# EAGLE design Pro_Micro (EAGLE 6.4)
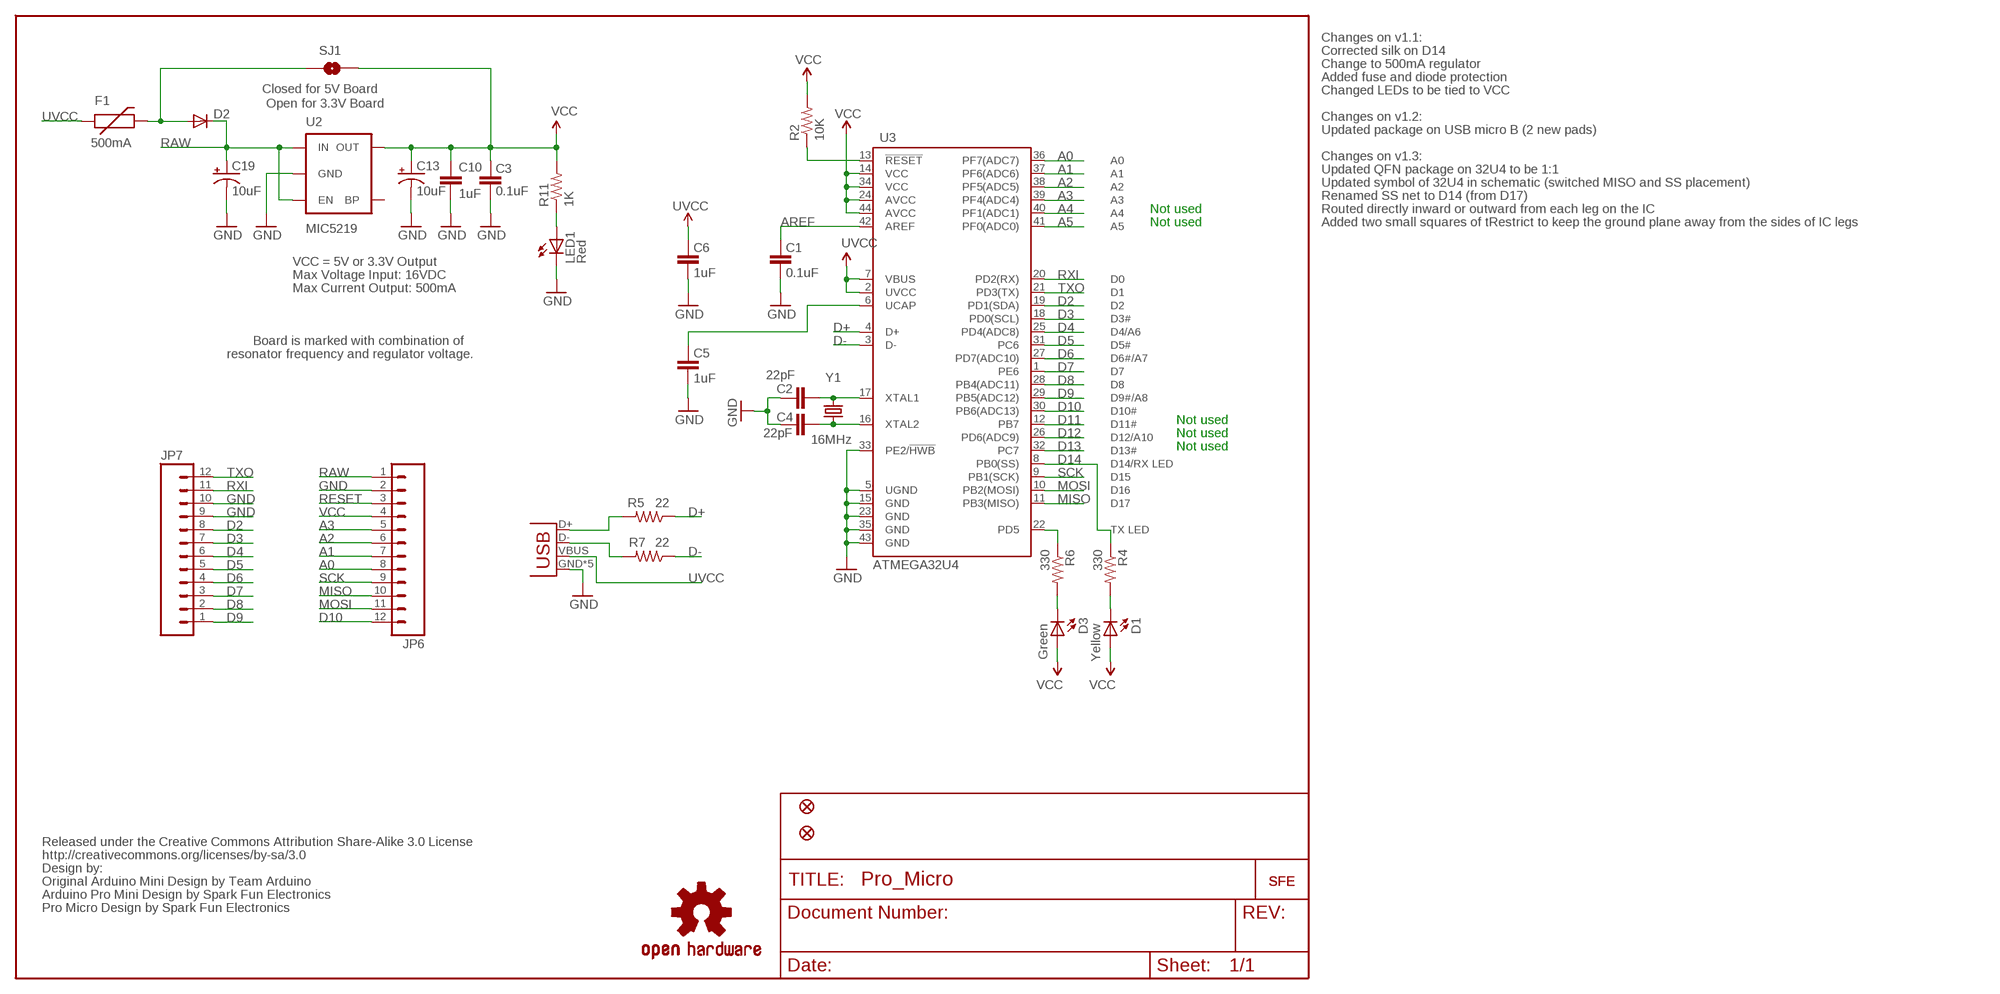
[diagram p0: schematic, sheet 1]

## Parts
C1  0.1uF  CAP0603-CAP  [0603-CAP]
C2  22pF  CAP0603-CAP  [0603-CAP]
C3  0.1uF  CAP0603-CAP  [0603-CAP]
C4  22pF  CAP0603-CAP  [0603-CAP]
C5  1uF  CAP0603-CAP  [0603-CAP]
C6  1uF  CAP0603-CAP  [0603-CAP]
C10  1uF  CAP0603-CAP  [0603-CAP]
C13  10uF  CAP_POL1206  [EIA3216]
C19  10uF  CAP_POL1206  [EIA3216]
D1  Yellow  LED0603  [LED-0603]
D2  DIODESOD  [SOD-323]
D3  Green  LED0603  [LED-0603]
F1  500mA  PTCSMD  [PTC-1206]
JP1  FIDUCIALUFIDUCIAL  [MICRO-FIDUCIAL]
JP2  FIDUCIALUFIDUCIAL  [MICRO-FIDUCIAL]
JP6  M12PTH  [1X12]
JP7  M12PTH  [1X12]
LED1  Red  LED0603  [LED-0603]
R2  10K  RESISTOR0603-RES  [0603-RES]
R4  330  RESISTOR0603-RES  [0603-RES]
R5  22  RESISTOR0603-RES  [0603-RES]
R6  330  RESISTOR0603-RES  [0603-RES]
R7  22  RESISTOR0603-RES  [0603-RES]
R11  1K  RESISTOR0603-RES  [0603-RES]
SJ1  Closed for 5V Board  SOLDERJUMPERNC  [SJ_2S]
U2  MIC5219  V_REG_LDOSMD  [SOT23-5]
U3  ATMEGA32U4  ATMEGA32U41:1  [QFN-44-NOPAD_1:1]
U$1  LOGO-SFESK  [SFE-LOGO-FLAME]
U$3  OSHW-LOGOS  [OSHW-LOGO-S]
U$5  CREATIVE_COMMONS  [CREATIVE_COMMONS]
U$11  LOGO-SFENEW  [SFE-NEW-WEBLOGO]
X1  USB-MICROB  [USB-MICROB]
Y1  16MHz  CRYSTAL5X3  [CRYSTAL-SMD-5X3]

## Nets
A0: JP6.8 U3.36(PF7(ADC7))
A1: JP6.7 U3.37(PF6(ADC6))
A2: JP6.6 U3.38(PF5(ADC5))
A3: JP6.5 U3.39(PF4(ADC4))
A4: U3.40(PF1(ADC1))
A5: U3.41(PF0(ADC0))
AREF: C1.2 U3.42(AREF)
D2: JP7.8 U3.19(PD1(SDA))
D3: JP7.7 U3.18(PD0(SCL))
D4: JP7.6 U3.25(PD4(ADC8))
D5: JP7.5 U3.31(PC6)
D6: JP7.4 U3.27(PD7(ADC10))
D7: JP7.3 U3.1(PE6)
D8: JP7.2 U3.28(PB4(ADC11))
D9: JP7.1 U3.29(PB5(ADC12))
D10: JP6.12 U3.30(PB6(ADC13))
D11: U3.12(PB7)
D12: U3.26(PD6(ADC9))
D13: U3.32(PC7)
D14: R4.1 U3.8(PB0(SS))
D+: R5.1 U3.4(D+)
D-: R7.1 U3.3(D-)
GND [vcc]: C1.1 C2.2 C3.1 C4.2 C5.1 C6.1 C10.2 C13.C(-) C19.C(-) JP6.2 JP7.9 JP7.10 LED1.C U2.2(GND) U3.5(UGND) U3.15(GND) U3.23(GND) U3.33(PE2/!HWB) U3.35(GND) U3.43(GND) X1.GND X1.MT1(GND) X1.MT2(GND) X1.MT3(GND) X1.MT4(GND)
MISO: JP6.10 U3.11(PB3(MISO))
MOSI: JP6.11 U3.10(PB2(MOSI))
N$1: C4.1 U3.16(XTAL2) Y1.1
N$2: C2.1 U3.17(XTAL1) Y1.3
N$3: D2.2(A) F1.2 SJ1.1
N$4: C5.2 U3.6(UCAP)
N$5: D1.C R4.2
N$6: R7.2 X1.D-
N$7: D3.C R6.2
N$8: R5.2 X1.D+
N$38: LED1.A R11.1
RAW [vcc]: C19.A(+) D2.1(C) JP6.1 U2.1(IN) U2.3(EN)
RESET: JP6.3 R2.1 U3.13(!RESET)
RXI: JP7.11 U3.20(PD2(RX))
SCK: JP6.9 U3.9(PB1(SCK))
TXLED: R6.1 U3.22(PD5)
TXO: JP7.12 U3.21(PD3(TX))
UVCC: C6.2 F1.1 U3.2(UVCC) U3.7(VBUS) X1.VBUS
VCC: C3.2 C10.1 C13.A(+) D1.A D3.A JP6.4 R2.2 R11.2 SJ1.2 U2.5(OUT) U3.14(VCC) U3.24(AVCC) U3.34(VCC) U3.44(AVCC)
Unconnected: U2.4(BP)

## Notes on the sheet
- Changes on v1.1:
- Corrected silk on D14
- Change to 500mA regulator
- Added fuse and diode protection
- Changed LEDs to be tied to VCC
- Open for 3.3V Board
- Changes on v1.2:
- Updated package on USB micro B (2 new pads)
- Changes on v1.3:
- Updated QFN package on 32U4 to be 1:1
- Updated symbol of 32U4 in schematic (switched MISO and SS placement)
- Renamed SS net to D14 (from D17)
- Not used | Routed directly inward or outward from each leg on the IC
- Not used | Added two small squares of tRestrict to keep the ground plane away from the sides of IC legs
- VCC = 5V or 3.3V Output
- Max Voltage Input: 16VDC
- Max Current Output: 500mA
- Board is marked with combination of
- resonator frequency and regulator voltage.
- Not used
- Not used
- Not used
- Original Arduino Mini Design by Team Arduino
- Arduino Pro Mini Design by Spark Fun Electronics
- Pro Micro Design by Spark Fun Electronics

## Library data of the parts
C1-C6 C10 = SparkFun:CAP: Capacitor Standard 0603 ceramic capacitor, and 0.1" leaded capacitor.
C13 C19 = SparkFun:CAP_POL: Capacitor Polarized These are standard SMD and PTH capacitors. Normally 10uF, 47uF, and 100uF in electrolytic and tantalum varieties. Always verify the external diameter of the through hole cap, it varies with capacity, voltage, and manufacturer. The EIA devices should be standard.
D1 D3 LED1 = SparkFun:LED: LEDs Standard schematic elements and footprints for 5mm, 3mm, 1206, and 0603 sized LEDs. 5mm - Spark Fun Electronics SKU : COM-00529 (and others)
D2 = SparkFun:DIODE: Diode These are standard reverse protection diodes and small signal diodes. SMA package can handle up to about 1A. SOD-323 can handle about 200mA. What the SOD-323 package when ordering, there are some mfgs out there that are 5-pin packages.
F1 = SparkFun:PTC: Resettable Fuse PTC Resettable Fuse. Spark Fun Electronics SKU : COM-08357
JP1 JP2 = SparkFun:FIDUCIAL: Fiducial Alignment Points Various fiducial points for machine vision alignment.
JP6 JP7 = SparkFun:M12: Header 12 Standard 12-pin 0.1" header. Use with straight break away headers (SKU : PRT-00116), right angle break away headers (PRT-00553), swiss pins (PRT-00743), machine pins (PRT-00117), and female headers (PRT-00115).
R2 R4-R7 R11 = SparkFun:RESISTOR: Resistor Basic schematic elements and footprints for 0603, 1206, and PTH resistors.
SJ1 = SparkFun:SOLDERJUMPER: Solder Jumper Standard SMD solder jumper. Used to automate production. Two varients : Normally Open and Normally Closed are the same, but have different paste layers. NC will have a large amount of paste and should jumper during reflow.
U2 = SparkFun:V_REG_LDO: Voltage Regulator LDO Standard 150mA LDO voltage regulator in SOT-23 layout. Micrel part MIC5205. BP (by-pass) pin is used to lower output noise with 470pF cap.
U3 = Testing:ATMEGA32U4: Atmel 44-pin 8-bit Microcontroller with 32KBytes of ISP Flash and USB Controller
U$1 U$11 = SparkFun:LOGO-SFE: Spark Fun Electronics PCB Logo This is the standard Spark Fun Electronics PCB logo.
U$3 = SparkFun:OSHW-LOGO: Open Source Hardware Logo This logo indicates the piece of hardware it is found on incorporates a OSHW license and/or adheres to the definition of open source hardware found here: http://freedomdefined.org/OSHW
U$5 = SparkFun:CREATIVE_COMMONS
X1 = SparkFun-Connectors:USB: USB Connectors USB-B-PTH is fully proven SKU : PRT-00139/CONN-08278 USB-miniB is fully proven SKU : PRT-00587 USB-A-PCB is untested. USB-A-H is throughly reviewed, but untested. Spark Fun Electronics SKU : PRT-00437 USB-B-SMT is throughly reviewed, but untested. Needs silkscreen touching up. USB-A-S has not been used/tested USB-MB-H has not been used/tested USB-MICROB has been used. CONN-09505; PROD_ID: CONN-09505
Y1 = SparkFun:CRYSTAL: Crystals Various standard crystals. Proven footprints. Spark Fun Electronics SKU : COM-00534

## Net classes
0 default: width 0.203 mm

## Board
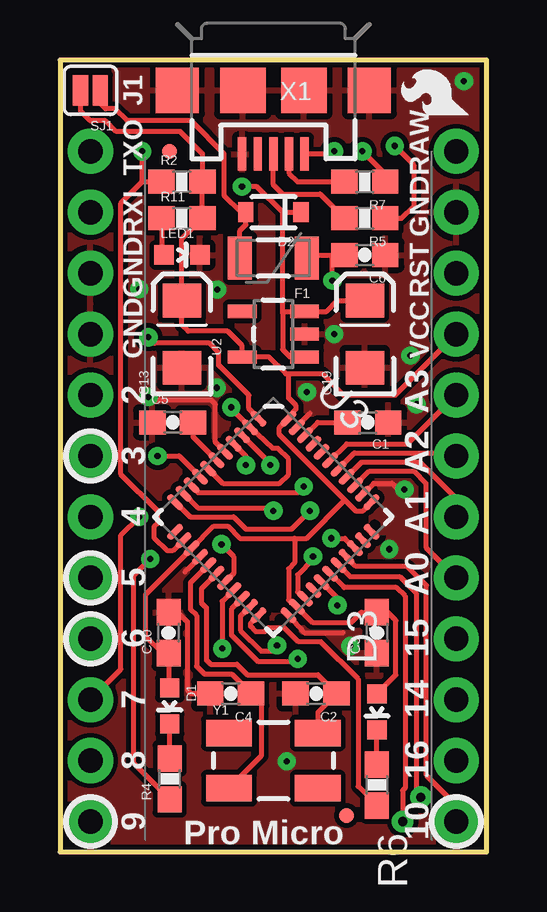
[diagram p1: board, top side]
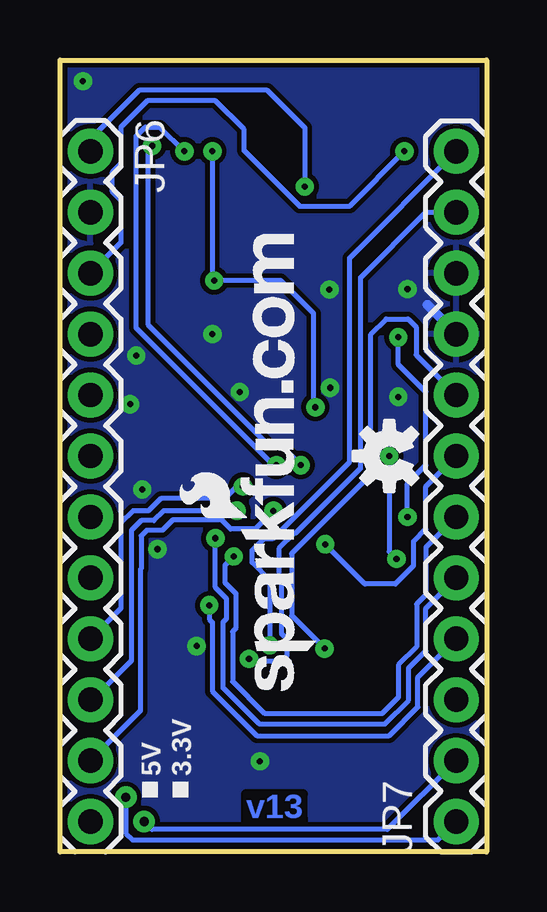
[diagram p2: board, bottom side, seen from below]

Size 17.78 x 33.02 mm. Coordinates in mm from the lower left corner, seen from the top.
Outline: 0,33.02 0,0 17.78,0 17.78,33.02 0,33.02
Copper layers (1*16): Top 0.035mm / dielectric 1.5mm / Bottom 0.035mm
Design rules "SparkFun *": minimum track width 8mil, minimum drill 15mil, track to track 7mil, track to pad 7mil, pad to pad 7mil, via to via 7mil, smd to smd 7mil, copper to edge 7mil, drill to drill 7mil, minimum pad ring 12mil, minimum via ring 10mil, stop-mask expansion 4mil, vias tented up to drill 20mil, thermal gap 10mil
tRestrict: area 9.1,9.6 to 9.3,9.7; area 13.1,13.6 to 13.1,13.7

### Footprints (pad centres in the part's own frame; a part is rotated, then mirrored left to right if it is on the bottom)
0603-CAP = smd 1.1 x 1: 1 -0.85,0; 2 0.85,0
EIA3216 = smd 1.4 x 1.6: A 1.4,0; C -1.4,0
LED-0603 = smd 0.8 x 0.8: A 0,-0.75; C 0,0.75
SOD-323 = smd 0.63 x 0.83: 1 -1.15,0; 2 1.15,0
PTC-1206 = smd 1 x 1.8: 1 -1.4,0; 2 1.4,0
MICRO-FIDUCIAL = smd 0.635 x 0.635: 1 0,0
1X12 = drill 1.016 pad 1.88: 1 0,0; 2 2.54,0; 3 5.08,0; 4 7.62,0; 5 10.16,0; 6 12.7,0; 7 15.24,0; 8 17.78,0; 9 20.32,0; 10 22.86,0; 11 25.4,0; 12 27.94,0
0603-RES = smd 1.1 x 1: 1 -0.85,0; 2 0.85,0
SJ_2S = smd 0.635 x 1.27: 1 -0.412,0; 2 0.412,0
SOT23-5 = smd 0.55 x 1.2: 1 -0.95,-1.3; 2 0,-1.3; 3 0.95,-1.3; 4 0.95,1.3; 5 -0.95,1.3
QFN-44-NOPAD_1:1 = smd 0.8 x 0.3: 1 -3.337,2.458; 2 -3.337,1.958; 3 -3.337,1.479; 4 -3.337,0.979; 5 -3.337,0.5; 6 -3.337,0; 7 -3.337,-0.5; 8 -3.337,-0.979; 9 -3.337,-1.479; 10 -3.337,-1.958; 11 -3.337,-2.458; 23 3.337,-2.458; 24 3.337,-1.958; 25 3.337,-1.479; 26 3.337,-0.979; 27 3.337,-0.5; 28 3.337,0; 29 3.337,0.5; 30 3.337,0.979; 31 3.337,1.479; 32 3.337,1.958; 33 3.337,2.458 | smd 0.3 x 0.8: 12 -2.458,-3.337; 13 -1.958,-3.337; 14 -1.479,-3.337; 15 -0.979,-3.337; 16 -0.5,-3.337; 17 0,-3.337; 18 0.5,-3.337; 19 0.979,-3.337; 20 1.479,-3.337; 21 1.958,-3.337; 22 2.458,-3.337; 34 2.458,3.337; 35 1.958,3.337; 36 1.479,3.337; 37 0.979,3.337; 38 0.5,3.337; 39 0,3.337; 40 -0.5,3.337; 41 -0.979,3.337; 42 -1.479,3.337; 43 -1.958,3.337; 44 -2.458,3.337
USB-MICROB = smd 0.35 x 1.4: D+ 0,2.65; D- -0.65,2.65; GND 1.3,2.65; ID 0.65,2.65; VBUS -1.3,2.65 | smd 1.8 x 1.9: MT1 -4,0; MT2 4,0 | smd 1.9 x 1.9: MT3 -1.27,0; MT4 1.27,0
CRYSTAL-SMD-5X3 = smd 1.9 x 1.1: 1 -1.85,-1.15; 2 1.85,-1.15; 3 1.85,1.15; 4 -1.85,1.15

### Placement (x,y rotation side)
C1  12.83,17.91 180 top
C2  10.67,6.6 180 top
C3  13.21,9.14 90 top
C4  7.11,6.6 180 top
C5  4.7,17.91 0 top
C6  12.7,24.89 180 top
C10  4.52,9.14 90 top
C13  5.08,21.59 90 top
C19  12.7,21.59 90 top
D1  4.57,6.1 180 top
D2  8.89,26.67 180 top
D3  13.21,5.84 180 top
F1  8.89,24.77 180 top
JP1  11.94,1.52 0 top
JP2  4.57,29.21 0 top
JP6  16.51,29.21 270 bottom
JP7  1.27,1.27 90 bottom
LED1  5.08,24.89 270 top
R2  5.08,27.94 0 top
R4  4.57,3.05 90 top
R5  12.7,26.42 180 top
R6  13.21,2.79 90 top
R7  12.7,27.94 180 top
R11  5.08,26.42 0 top
SJ1  1.27,31.75 180 top
U2  8.89,21.59 90 top
U3  8.89,13.97 315 top
U$1  17.02,30.73 90 top
U$3  4.06,16.51 90 bottom
U$5  -16.51,-10.16 0 top  (outside the outline)
U$11  7.11,6.73 90 bottom
X1  8.89,31.75 180 top
Y1  8.89,3.81 0 top

### Tracks (layer width: path | path; a pad name or v marks a point on that pad's centre or on a via)
A0
  Top 0.203: JP6.8 15.24,12.7 15.24,15.37 14.73,15.88 12.89,15.88 U3.36
A1
  Top 0.203: U3.37 12.56,16.26 14.99,16.26 16.51,14.73 JP6.7
A2
  Top 0.203: U3.38 12.26,16.64 16.38,16.64 JP6.6
A3
  Top 0.203: U3.39 11.94,17.02 14.48,17.02 JP6.5
AREF
  Top 0.203: U3.42 10.74,17.91 C1.2
D2  (via drill 0.25)
  Top 0.203: U3.19 6.76,10.45 v6.76,8.48
  Bottom 0.203: JP7.8 2.95,20.73 2.95,21.89 3.28,22.23 4.19,22.23 4.83,21.59 4.83,15.75 8.13,12.45 8.13,9.86 v6.76,8.48
D3  (via drill 0.25)
  Top 0.203: v6.73,12.83 7.24,12.32 7.24,11.61 U3.18
  Bottom 0.203: JP7.7 2.54,15.24 2.54,13.46 3.05,12.95 3.05,11.94 3.81,11.18 5.08,11.18 v6.73,12.83
D4  (via drill 0.25)
  Top 0.203: U3.25 9.91,10.83 9.91,11.56 10.54,12.19 v10.54,12.32
  Bottom 0.203: JP7.6 2.54,12.7 2.54,10.72 2.92,10.34 2.92,8.56 3.68,7.8 3.68,6.45 4.37,5.77 9.25,5.77 10.59,7.11 10.59,9.2 10.44,9.35 10.44,10.77 10.9,11.23 10.9,11.96 v10.54,12.32
D5  (via drill 0.25)
  Top 0.203: U3.31 11.88,13.08 v11.3,13.08
  Bottom 0.203: v11.3,13.08 11.3,11.02 10.85,10.57 10.85,9.73 11,9.58 11,6.86 9.47,5.33 4.24,5.33 3.25,6.33 3.25,7.67 2.54,8.38 2.54,10.16 JP7.5
D6  (via drill 0.25)
  Top 0.203: 11.56,10.6 v11.56,10.29 11.56,10.6 | U3.27 11.56,10.6
  Bottom 0.203: v11.56,10.29 11.56,9.7 11.43,9.58 11.43,6.71 9.58,4.85 4.06,4.85 2.87,6.04 2.87,7.29 JP7.4
D7  (via drill 0.25)
  Top 0.203: U3.1 8.29,18.07 7.87,18.48 7.87,19.05 6.6,20.32 6.6,20.83 6.22,21.21 3.94,21.21 v3.68,21.46 | JP7.3 2.54,7.62 2.54,13.21 v3.3,13.97
  Bottom 0.203: v3.3,13.97 3.3,15.37 2.54,16.13 2.54,19.18 3.68,20.32 v3.68,21.46
D8  (via drill 0.38)
  Top 0.203: v14.28,1.27 14.28,2.56 14.38,2.67 14.38,10.67 14.02,11.02 11.84,11.02 U3.28
  Bottom 0.203: JP7.2 4.14,0.94 13.95,0.94 v14.28,1.27
D9  (via drill 0.38)
  Top 0.203: v15.04,2.29 14.83,2.49 14.83,10.79 14.15,11.48 12.09,11.48 U3.29
  Bottom 0.203: JP7.1 2.03,0.51 14.76,0.51 15.04,0.79 v15.04,2.29
D10
  Top 0.203: U3.30 12.33,11.91 14.48,11.91 15.27,11.12 15.27,3.2 16.51,1.96 JP6.12
D14  (via drill 0.25)
  Top 0.203: U3.8 4.96,16.51 v4.06,16.51 | R4.1 3.05,3.72 3.05,11.51 v3.76,12.22
  Bottom 0.203: v4.06,16.51 4.06,12.52 v3.76,12.22
D+  (via drill 0.25)
  Top 0.203: v7.75,16.13 7.75,16.5 U3.4 | R5.1 14.22,26.42 14.73,26.92 14.73,28.65 v13.95,29.44
  Bottom 0.203: v7.75,16.13 8.51,16.89 9.02,16.89 14.1,21.97 14.1,29.29 v13.95,29.44
D-  (via drill 0.25)
  Top 0.203: v8.76,16.13 8.79,16.17 U3.3 | R7.1 13.55,28.26 v12.6,29.21
  Bottom 0.203: v8.76,16.13 8.89,16.13 14.61,21.84 14.61,29.84 14.22,30.23 13.61,30.23 v12.6,29.21
GND  (via drill 0.25)
  Top 0.203: U3.23 10.18,9.14 11.8,9.14 | U3.35 13.06,15.37 13.84,15.37 14.1,15.11 v14.35,15.11 | U3.15 5.33,11.8 5.21,11.68 | U3.43 9.87,17.74 10.41,18.29 | U3.5 6.48,17.09 6.48,18.67 6.3,18.85 3.81,18.85 3.71,18.95 | C4.2 5.46,6.6 5.31,6.76 5.31,9.6 4.92,9.99 C10.2
  Bottom 0.406: JP7.9 1.27,21.61 2.46,22.81
  other vias: 9.45,3.78 3.68,18.97 14.86,18.67 11.43,21.59 10.29,19.18 6.53,19.35 16.83,32.13 13.72,12.62 6.55,23.44 12.09,8.59 14.61,20.7 3.3,23.47
  pour Top (isolate 0.203): 0,33.02 17.78,33.02 17.78,0 0,0
  pour Bottom (isolate 0.203): 0,33.02 17.78,33.02 17.78,0 0,0
MISO  (via drill 0.25)
  Top 0.203: U3.11 5.42,13.97 7.24,13.97 7.75,13.46 9.65,13.46 v10.41,14.22
  Bottom 0.203: v10.41,14.22 13.46,14.22 13.87,13.82 14.4,13.82 14.81,13.41 14.81,7.98 16.43,6.35 JP6.10
MOSI  (via drill 0.25)
  Top 0.203: U3.10 5.74,14.35 8.76,14.35 v8.89,14.22
  Bottom 0.203: JP6.11 14.43,5.89 14.43,11.79 14.4,11.81 14.4,13.18 14.17,13.41 13.51,13.41 13.08,13.84 11.05,13.84 10.67,13.46 9.65,13.46 v8.89,14.22
N$1
  Top 0.203: U3.16 5.71,11.5 5.44,11.22 5.44,10.11 5.69,9.86 5.69,7.75 6.02,7.42 7.15,7.42 C4.1 8.38,6.6 8.38,4 Y1.1
N$2
  Top 0.203: Y1.3 10.74,5.83 C2.1 11.52,6.62 10.74,7.39 7.8,7.39 7.37,7.82 6.27,7.82 6.1,8 6.1,10.19 5.89,10.39 5.89,10.97 U3.17
N$3
  Top 0.203: F1.2 7.49,25.91 7.74,26.16 D2.2 7.54,26.67 6.83,27.38 6.83,29.11 5.46,30.48 2.79,30.48 2.29,30.99 1.91,30.99 1.68,31.21 SJ1.1
N$4
  Top 0.203: U3.6 5.55,17.31 C5.2
N$5
  Top 0.203: R4.2 D1.C
N$6
  Top 0.203: X1.D- 9.54,28.31 9.91,27.94 R7.2
N$7
  Top 0.203: R6.2 D3.C
N$8
  Top 0.203: X1.D+ 8.89,27.81 9.27,27.43 10.83,27.43 R5.2
N$38
  Top 0.203: R11.1 4.23,24.99 LED1.A
RAW  (via drill 0.25)
  Top 0.203: C19.A 11.56,22.99 11.11,22.54 U2.3 9.33,22.54 9.27,22.48 | U2.1 9.59,20.64 9.27,20.95 9.27,22.48 | 9.27,26.67 D2.1 | 9.27,22.48 9.27,26.67 | 9.27,26.67 8.2,27.74 v7.58,27.74
  Bottom 0.203: JP6.1 16.51,29.72 14.48,31.75 9.14,31.75 7.58,30.19 v7.58,27.74
RESET  (via drill 0.25)
  Top 0.203: 3.43,27.94 v3.43,29.21 | U3.13 4.71,12.57 4.45,12.57 3.94,13.08 3.94,13.59 4.06,13.72 4.06,14.22 2.54,15.75 2.54,27.05 3.43,27.94 | 3.43,27.94 R2.1
  Bottom 0.203: JP6.3 15.24,25.4 15.24,27.18 15.62,27.56 15.62,28.32 15.24,28.7 15.24,30.23 14.15,31.32 11.3,31.32 10.11,30.12 10.11,29.23 7.8,26.92 5.71,26.92 v3.43,29.21
RXI  (via drill 0.25)
  Top 0.203: U3.20 7.14,10.13 7.14,9.04 8.23,7.95 9.8,7.95 v9.91,8.05
  Bottom 0.203: JP7.11 2.54,26.67 5.26,23.95 5.26,16 7.98,13.28 8.03,13.28 8.66,12.65 8.66,11.51 8.56,11.4 8.56,9.12 8.33,8.89 8.33,8.18 8.56,7.95 9.8,7.95 v9.91,8.05
SCK  (via drill 0.25)
  Top 0.203: v10.16,15.24 9.91,14.99 5.75,14.99 U3.9
  Bottom 0.203: JP6.9 15.24,10.16 15.24,13.72 14.73,14.22 14.1,14.22 13.59,14.73 10.92,14.73 10.41,15.24 v10.16,15.24
TXLED
  Top 0.203: U3.22 7.94,9.53 7.94,9.4 8.14,9.2 8.53,9.2 8.69,9.35 9.35,9.35 9.93,8.76 10.87,8.76 12.42,7.21 12.42,2.73 R6.1
TXO  (via drill 0.25)
  Top 0.203: U3.21 7.52,9.83 7.52,9.25 8.38,8.38 9.04,8.38 v9.04,8.61
  Bottom 0.203: JP7.12 5.71,24.77 5.71,16.26 8.89,13.08 9.27,13.08 9.78,12.57 9.78,12.06 9.04,11.33 v9.04,8.61
UVCC  (via drill 0.25)
  Top 0.203: U3.7 6.79,15.37 9.14,15.37 9.53,15.75 9.53,16.38 9.08,16.83 8.86,16.83 U3.2 7.14,18.49 v7.14,18.54 | X1.VBUS 11.32,29.1 v11.43,29.21 | F1.1 10.42,24.89 C6.2 11.35,24.89 v11.35,23.82
  Bottom 0.203: v7.14,18.54 7.21,18.62 7.21,22.45 8.59,23.82 v11.35,23.82 11.43,23.9 v11.43,29.21
VCC
  Top 0.203: U3.34 12.63,14.22 12.32,14.22 11.87,14.67 | 9.78,13.08 7.49,13.08 6.99,13.59 6.41,13.59 U3.14 3.56,10.73 3.56,9.02 4.28,8.29 C10.1 4.52,6.9 D1.A | 9.78,13.08 9.78,12.06 9.53,11.81 9.53,10.51 U3.24 10.52,9.58 12.14,9.58 12.56,9.99 C3.2 13.65,9.99 13.99,9.65 13.99,7.38 D3.A | 11.87,14.67 9.14,17.4 9.14,17.7 U3.44 9.53,18.14 9.84,18.46 9.84,18.61 9.53,18.92 9.53,19.94 | 9.78,13.08 10.29,13.08 11.87,14.67 | 9.53,19.94 9.4,19.94 8.7,20.64 U2.5 7.59,21.11 6.99,21.72 5.33,21.72 5.08,21.97 C13.A 5.08,25.57 R11.2 R2.2 5.93,29.12 5.02,30.04 2.35,30.04 1.91,30.48 1.27,30.48 0.86,30.89 SJ1.2 | 9.53,19.94 10.92,19.94 11.81,19.05 13.97,19.05 JP6.4

### Text on the board
Bottom: v13
tPlace: J1 | TXO | RAW | RXI | GND | GND | RST | GND | VCC | 2 | A3 | 3 | A2 | 4 | A1 | 5 | A0 | 6 | 15 | 7 | 14 | 8 | 16 | 9 | 10 | Pro Micro | N. Seidle
bPlace: 3.3V | 5V
tValues: Valid combinations: | 3.3V Reg / 8MHz | 5V Reg / 16MHz | Mark back accordingly